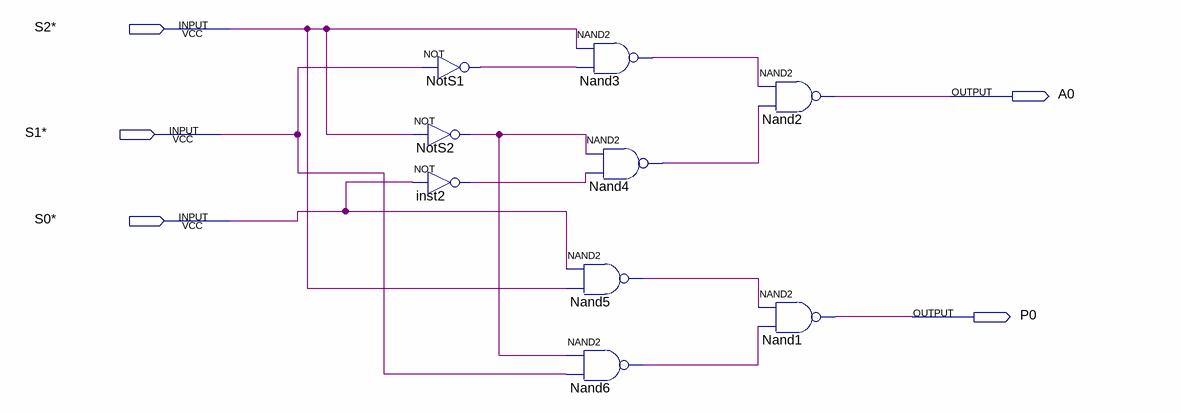
[diagram p0: schematic sheet]
// Quartus schematic Lab5NOR.bdf as structural Verilog: 9 symbols, 5 pins
module Lab5NOR (
  input  \S2* ,
  input  \S1* ,
  input  \S0* ,
  output A0,
  output P0
);

  wire inst2_out, Nand3_out, Nand4_out, Nand5_out, Nand6_out, NotS1_out, NotS2_out;

  not NotS1 (NotS1_out, \S1* );
  not NotS2 (NotS2_out, \S2* );
  not inst2 (inst2_out, \S0* );
  nand Nand3 (Nand3_out, \S2* , NotS1_out);
  nand Nand4 (Nand4_out, NotS2_out, inst2_out);
  nand Nand5 (Nand5_out, \S0* , \S2* );
  nand Nand6 (Nand6_out, NotS2_out, \S1* );
  nand Nand2 (A0, Nand3_out, Nand4_out);
  nand Nand1 (P0, Nand5_out, Nand6_out);
endmodule
